# Altium project Main_PCB.PrjPcb
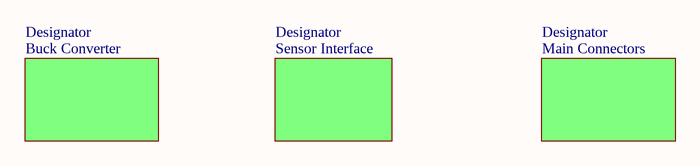
[diagram p0: MainPCB.SchDoc]
4 sheets, 53 parts. Net scope: flat (ports and power ports of the same name join across sheets).
Board file: MainPCB.PcbDoc
Sheets:
  MainPCB.SchDoc
    Designator = Buck Converter.SchDoc
    Designator = Sensor Interface.SchDoc
    Designator = Main Connectors.SchDoc

## Sheet MainPCB.SchDoc
size A4; SheetNumber: 1; SheetTotal: 4

### Sub-sheets
Designator = Buck Converter: no entries
Designator = Sensor Interface: no entries
Designator = Main Connectors: no entries

## Sheet Buck Converter.SchDoc
size A4; SheetNumber: 4; SheetTotal: 4
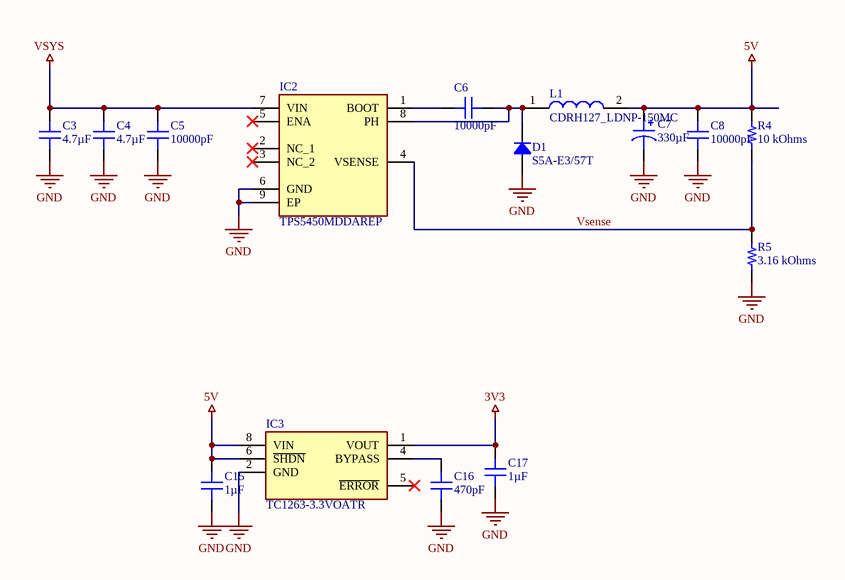
[diagram p1: Buck Converter.SchDoc]

### Parts
C3  4.7µF  [CAP 1206_3216 - 1.0MM]
C4  4.7µF  [CAP 1206_3216 - 1.0MM]
C5  10000pF  [CAP 0603_1608]
C6  10000pF  [CAP 0603_1608]
C7  330µF  [CAP ALSMD 6.6MM H7.7MM]
C8  10000pF  [CAP 0603_1608]
C15  1µF  [CAP 0603_1608]
C16  470pF  [CAP 0603_1608]
C17  1µF  [CAP 0603_1608]
D1  S5A-E3/57T  [DO214AB SMC]
IC2  TPS5450MDDAREP  [SOIC127P600X170-9N]
IC3  TC1263-3.3VOATR  [SOIC127P600X175-8N]
L1  CDRH127_LDNP-150MC  [INDPM120120X800N]
R4  10 kOhms  [RES 0603_1608]
R5  3.16 kOhms  [RES 0603_1608]

### Nets
3V3: C17.2 IC3.1(VOUT)
5V: C7.1 C8.2 C15.2 IC3.6(~{SHDN}) IC3.8(VIN) L1.2 R4.2
GND: C3.1 C4.1 C5.1 C7.2 C8.1 C15.1 C16.1 C17.1 D1.1 IC2.6(GND) IC2.9(EP) IC3.2(GND) R5.1
VSYS: C3.2 C4.2 C5.2 IC2.7(VIN)
Vsense: IC2.4(VSENSE) R4.1 R5.2
NetC6_1: C6.1 D1.2 IC2.8(PH) L1.1
NetC6_2: C6.2 IC2.1(BOOT)
NetC16_2: C16.2 IC3.4(BYPASS)

Not connected (* = marked no-connect by the designer): IC2 2(NC_1)* 3(NC_2)* 5(ENA)*; IC3 5(~{ERROR})*

### Library data of the parts
C3 C4 = C3216X7R1E475K085AB: CAP CER 4.7UF 25V X7R 1206; Manufacturer: TDK Corporation; Tolerance: ±10%; Part Number: C3216X7R1E475K085AB; Value: 4.7µF; Applications: General Purpose; Capacitance: 4.7µF; ComponentLink1Description: Datasheet; ComponentLink1URL: https://product.tdk.com/info/en/catalog/datasheets/mlcc_commercial_general_en.pdf?ref_disty=digikey; ComponentLink2Description: DigiKey Link; ComponentLink2URL: http://digikey.com/product-detail/en/tdk-corporation/C3216X7R1E475K085AB/445-14797-1-ND/3956463; Device Package: 1206 (3216 Metric); Features: Low ESL; LastUpdated: 2020-09-02 1:05:06 AM; Lifecycle Status: Active; Minimum Order: 1; Mounting Type: Surface Mount, MLCC; Operating Temperature: -55°C ~ 125°C; Package / Case: 1206 (3216 Metric); Packaging: TapeAndReel; PartId: 19105; Part Status: Active; Price: 0.08; Series: C; Size / Dimension: 0.126" L x 0.063" W (3.20mm x 1.60mm); Supplier 1: DigiKey; Supplier Part Number 1: 445-14797-1-ND; Temperature Coefficient: X7R; Thickness (Max): 0.039" (1.00mm); Voltage - Rated: 25V
C5 C6 C8 = C0603C103K5RAC7081: CE SMD 0603 .01UF 10% 50V X7R 2M; Manufacturer: KEMET; Part Number: C0603C103K5RAC7081; Value: 10000pF; Applications: Bypass, Decoupling; Capacitance: 10000pF; ComponentLink1Description: Datasheet; ComponentLink1URL: https://api.kemet.com/component-edge/download/specsheet/C0603C103K5RAC7081.pdf; ComponentLink2Description: DigiKey Link; ComponentLink2URL: http://digikey.com/product-detail/en/kemet/C0603C103K5RAC7081/399-C0603C103K5RAC7081CT-ND/10483117; Device Package: 0603 (1608 Metric); LastUpdated: 2020-09-02 1:03:31 AM; Lifecycle Status: Active; Minimum Order: 1; Mounting Type: Surface Mount, MLCC; Operating Temperature: -55°C ~ 125°C; Package / Case: 0603 (1608 Metric); Packaging: TapeAndReel; PartId: 5246; Part Status: Active; Price: 0.01; Series: SMD Comm X7R; Size / Dimension: 0.063" L x 0.031" W (1.60mm x 0.80mm); Supplier 1: DigiKey; Supplier Part Number 1: 399-C0603C103K5RAC7081CT-ND; Temperature Coefficient: X7R; Thickness (Max): 0.034" (0.87mm); Tolerance: ±10%; Voltage - Rated: 50V
C7 = 875105245015: CAP ALUM POLY 330UF 20% 10V SMD; Manufacturer: Würth Elektronik; ESR (Equivalent Series Resistance): 20mOhm; Lifetime @ Temp.: 2000 Hrs @ 105°C; Ripple Current @ High Frequency: 2.69A @ 100kHz; Ripple Current @ Low Frequency: 134.5mA @ 120Hz; Surface Mount Land Size: 0.260" L x 0.260" W (6.60mm x 6.60mm); Type: Polymer; Part Number: 875105245015; Applications: General Purpose; Capacitance: 330µF; ComponentLink1Description: Datasheet; ComponentLink1URL: https://katalog.we-online.de/pbs/datasheet/875105245015.pdf; ComponentLink2Description: DigiKey Link; ComponentLink2URL: http://digikey.com/product-detail/en/w-rth-elektronik/875105245015/732-6415-1-ND/5147966; Device Package: Radial, Can - SMD; Height - Seated (Max): 0.303" (7.70mm); LastUpdated: 2020-09-02 1:25:32 AM; Lifecycle Status: Active; Minimum Order: 1; Mounting Type: Surface Mount; Operating Temperature: -55°C ~ 105°C; Package / Case: Radial, Can - SMD; Packaging: TapeAndReel; PartId: 2228; Part Status: Active; Price: 0.40; Series: WCAP-PSLP; Size / Dimension: 0.248" Dia (6.30mm); Supplier 1: DigiKey; Supplier Part Number 1: 732-6415-1-ND; Tolerance: ±20%; Value: 330µF; Voltage - Rated: 10V
C15 C17 = C0603C105K4RACAUTO: CAP CER 0603 1UF 16V X7R 10%; Manufacturer: KEMET; Part Number: C0603C105K4RACAUTO; Value: 1µF; Applications: Automotive, Bypass, Decoupling; Capacitance: 1µF; ComponentLink1Description: Datasheet; ComponentLink1URL: https://api.kemet.com/component-edge/download/datasheet/C0603C105K4RACAUTO.pdf; ComponentLink2Description: DigiKey Link; ComponentLink2URL: http://digikey.com/product-detail/en/kemet/C0603C105K4RACAUTO/399-17704-1-ND/8635855; Device Package: 0603 (1608 Metric); LastUpdated: 2020-09-02 1:03:36 AM; Lifecycle Status: Active; Minimum Order: 1; Mounting Type: Surface Mount, MLCC; Operating Temperature: -55°C ~ 125°C; Package / Case: 0603 (1608 Metric); Packaging: TapeAndReel; PartId: 2179; Part Status: Active; Price: 0.02; Ratings: AEC-Q200; Series: SMD Auto X7R; Size / Dimension: 0.063" L x 0.031" W (1.60mm x 0.80mm); Supplier 1: DigiKey; Supplier Part Number 1: 399-17704-1-ND; Temperature Coefficient: X7R; Thickness (Max): 0.037" (0.95mm); Tolerance: ±10%; Voltage - Rated: 16V
C16 = C0603C471J3GACAUTO: CAP CER 470PF 25V C0G/NP0 0603; Manufacturer: KEMET; Temperature Coefficient: C0G, NP0; Tolerance: ±5%; Part Number: C0603C471J3GACAUTO; Value: 470pF; Applications: Automotive; Capacitance: 470pF; ComponentLink1Description: Datasheet; ComponentLink1URL: https://api.kemet.com/component-edge/download/datasheet/C0603C471J3GACAUTO.pdf; ComponentLink2Description: DigiKey Link; ComponentLink2URL: http://digikey.com/product-detail/en/kemet/C0603C471J3GACAUTO/399-6891-1-ND/3314402; Device Package: 0603 (1608 Metric); Features: Low ESL; LastUpdated: 2020-09-02 1:03:35 AM; Lifecycle Status: Active; Minimum Order: 1; Mounting Type: Surface Mount, MLCC; Operating Temperature: -55°C ~ 125°C; Package / Case: 0603 (1608 Metric); Packaging: TapeAndReel; PartId: 2407; Part Status: Active; Price: 0.08; Ratings: AEC-Q200; Series: SMD Auto C0G; Size / Dimension: 0.063" L x 0.031" W (1.60mm x 0.80mm); Supplier 1: DigiKey; Supplier Part Number 1: 399-6891-1-ND; Thickness (Max): 0.034" (0.87mm); Voltage - Rated: 25V
D1 = S5A-E3/57T: DIODE GEN PURP 50V 5A DO214AB; Manufacturer: Vishay Semiconductor Diodes Division; Capacitance @ Vr, F: 40pF @ 4V, 1MHz; Current - Reverse Leakage @ Vr: 10µA @ 50V; Diode Type: Standard; Reverse Recovery Time (trr): 2.5µs; Speed: Standard Recovery >500ns, > 200mA (Io); Voltage - Forward (Vf) (Max) @ If: 1.15V @ 5A; Part Number: S5A-E3/57T; ComponentLink1Description: Datasheet; ComponentLink1URL: http://www.vishay.com/docs/88931/s5a.pdf; ComponentLink2Description: DigiKey Link; ComponentLink2URL: http://digikey.com/product-detail/en/vishay-semiconductor-diodes-division/S5A-E3-57T/S5A-E3-57TGICT-ND/3646220; Current - Average Rectified (Io): 5A; LastUpdated: 2020-09-02 1:18:57 AM; Lifecycle Status: Active; Minimum Order: 1; Mounting Type: Surface Mount; Operating Temperature - Junction: -55°C ~ 150°C; Package / Case: DO-214AB, SMC; Packaging: TapeAndReel; PartId: 381; Part Status: Active; Price: 0.20; Series: -; Supplier 1: DigiKey; Supplier Part Number 1: S5A-E3/57TGICT-ND; Supplier Device Package: DO-214AB (SMC); Voltage - DC Reverse (Vr) (Max): 50V
IC2 = TPS5450MDDAREP: Integrated Circuit; Manufacturer_Name: Texas Instruments; Datasheet Link: http://www.ti.com/lit/gpn/tps5450-ep; Height: 1.7mm; Manufacturer_Part_Number: TPS5450MDDAREP
IC3 = TC1263-3.3VOATR: Integrated Circuit; Manufacturer_Name: Microchip; Datasheet Link: http://ww1.microchip.com/downloads/en/DeviceDoc/21374D.pdf; Height: 1.75mm; Manufacturer_Part_Number: TC1263-3.3VOATR; Mouser Part Number: 579-TC1263-3.3VOATR; Mouser Price/Stock: https://www.mouser.co.uk/ProductDetail/Microchip-Technology/TC1263-33VOATR?qs=JKWmWPM4binFIJC0VNJYCQ%3D%3D; Arrow Part Number: TC1263-3.3VOATR; Arrow Price/Stock: https://www.arrow.com/en/products/tc1263-3.3voatr/microchip-technology
L1 = CDRH127_LDNP-150MC: Inductor; Manufacturer_Name: Sumida; Manufacturer_Part_Number: CDRH127/LDNP-150MC; Datasheet Link: https://componentsearchengine.com/Datasheets/1/CDRH127_LDNP-150MC.pdf; Height: 8mm; Mouser Part Number: 851-CDRH127LDNP150MC; Mouser Price/Stock: https://www.mouser.co.uk/ProductDetail/Sumida/CDRH127-LDNP-150MC?qs=UC6tolJH7OiTViEpne7nQQ%3D%3D; Arrow Part Number: CDRH127/LDNP-150MC; Arrow Price/Stock: https://www.arrow.com/en/products/cdrh127ldnp-150mc/sumida?region=nac
R4 = AF0603FR-0710KL: RES SMD 10K OHM 1% 1/10W 0603; Manufacturer: Yageo; Power (Watts): 0.1W, 1/10W; Temperature Coefficient: ±100ppm/°C; Part Number: AF0603FR-0710KL; Value: 10 kOhms; ComponentLink1Description: Datasheet; ComponentLink1URL: http://www.yageo.com/documents/recent/PYu-AF_51_RoHS_L_6.pdf; ComponentLink2Description: DigiKey Link; ComponentLink2URL: http://digikey.com/product-detail/en/yageo/AF0603FR-0710KL/311-10KLMCT-ND/2828170; Composition: Thick Film; Device Package: 0603 (1608 Metric); Features: Anti-Sulfur, Moisture Resistant; Height - Seated (Max): 0.022" (0.55mm); LastUpdated: 2020-09-02 1:10:01 AM; Lifecycle Status: Active; Minimum Order: 1; Number of Terminations: 2; Operating Temperature: -55°C ~ 155°C; Package / Case: 0603 (1608 Metric); Packaging: TapeAndReel; PartId: 16021; Part Status: Active; Price: 0.01; Resistance: 10 kOhms; Series: AF; Size / Dimension: 0.063" L x 0.031" W (1.60mm x 0.80mm); Supplier 1: DigiKey; Supplier Part Number 1: 311-10KLMCT-ND; Supplier Device Package: 0603; Tolerance: ±1%
R5 = CR0603-FX-3161ELF: RES SMD 3.16K OHM 1% 1/10W 0603; Manufacturer: Bourns Inc.; Power (Watts): 0.1W, 1/10W; Temperature Coefficient: ±100ppm/°C; Part Number: CR0603-FX-3161ELF; Value: 3.16 kOhms; ComponentLink1Description: Datasheet; ComponentLink1URL: https://www.bourns.com/docs/Product-Datasheets/CHPREZTR.pdf; ComponentLink2Description: DigiKey Link; ComponentLink2URL: http://digikey.com/product-detail/en/bourns-inc/CR0603-FX-3161ELF/CR0603-FX-3161ELFCT-ND/4247773; Composition: Thick Film; Device Package: 0603 (1608 Metric); Features: Moisture Resistant; Height - Seated (Max): 0.022" (0.55mm); LastUpdated: 2020-09-02 1:10:18 AM; Lifecycle Status: Active; Minimum Order: 1; Number of Terminations: 2; Operating Temperature: -55°C ~ 155°C; Package / Case: 0603 (1608 Metric); Packaging: CutTape; PartId: 8282; Part Status: Active; Price: 0.10; Resistance: 3.16 kOhms; Series: CR0603; Size / Dimension: 0.063" L x 0.031" W (1.60mm x 0.80mm); Supplier 1: DigiKey; Supplier Part Number 1: CR0603-FX-3161ELFCT-ND; Supplier Device Package: 0603; Tolerance: ±1%

## Sheet Sensor Interface.SchDoc
size A4; SheetNumber: 3; SheetTotal: 4
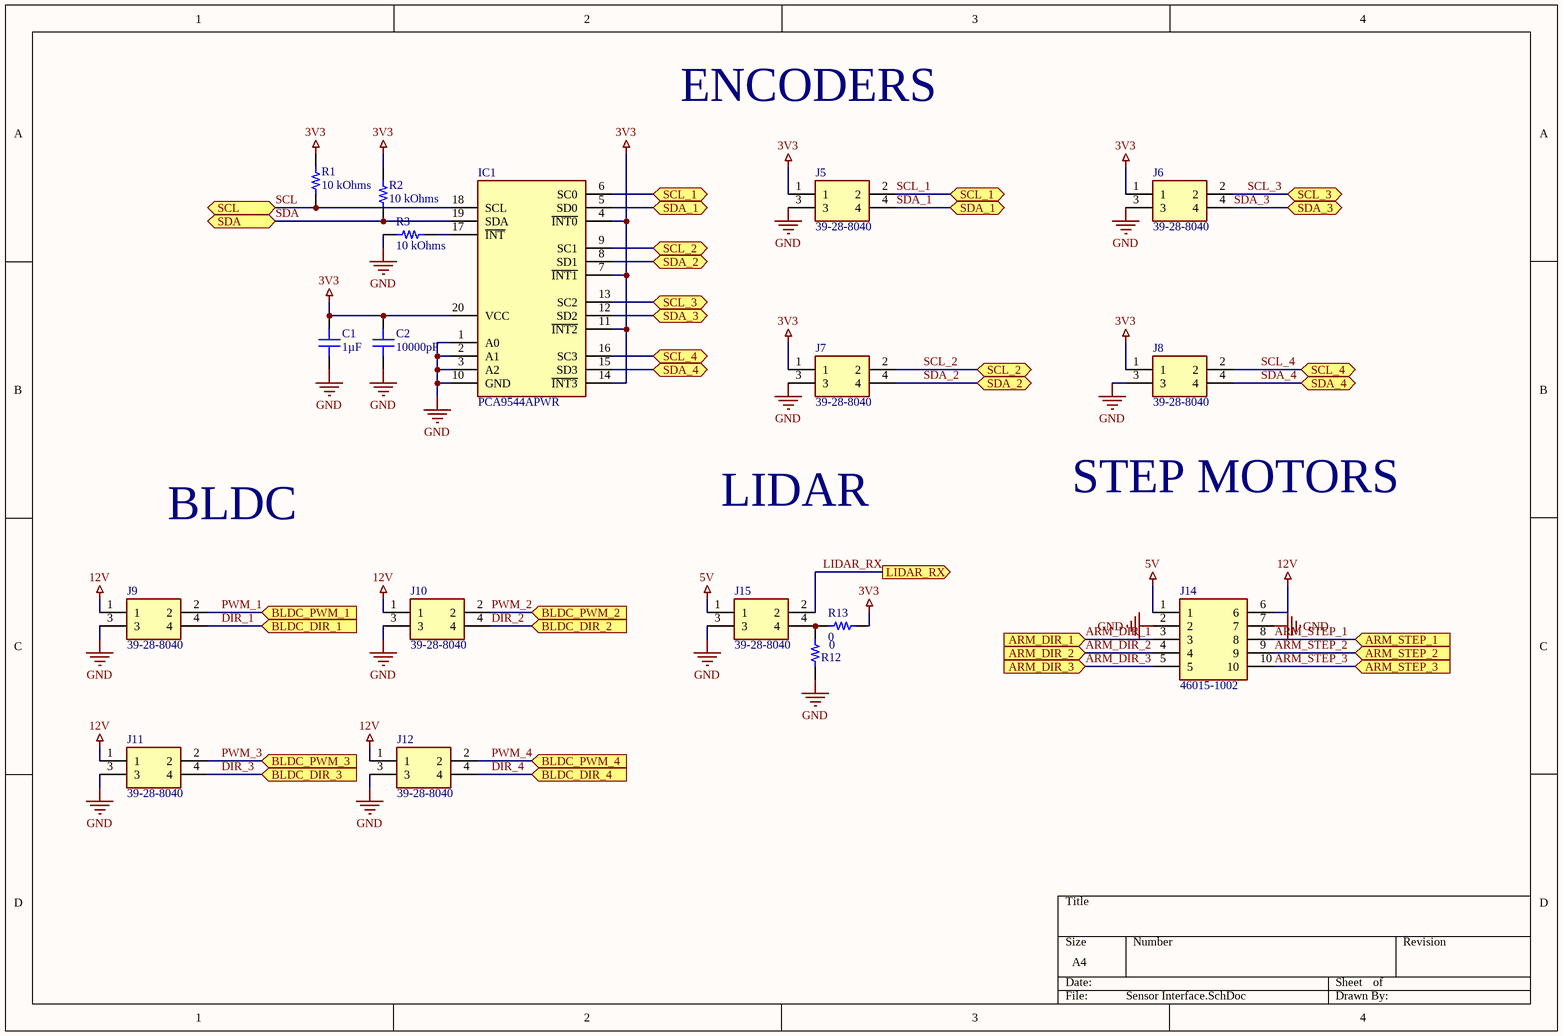
[diagram p2: Sensor Interface.SchDoc]

### Parts
C1  1µF  [CAP 0603_1608]
C2  10000pF  [CAP 0603_1608]
IC1  PCA9544APWR  [SOP65P640X120-20N]
J5  39-28-8040  [RHDR4W125P550X420_2X2_960X960X1310P]
J6  39-28-8040  [RHDR4W125P550X420_2X2_960X960X1310P]
J7  39-28-8040  [RHDR4W125P550X420_2X2_960X960X1310P]
J8  39-28-8040  [RHDR4W125P550X420_2X2_960X960X1310P]
J9  39-28-8040  [RHDR4W125P550X420_2X2_960X960X1310P]
J10  39-28-8040  [RHDR4W125P550X420_2X2_960X960X1310P]
J11  39-28-8040  [RHDR4W125P550X420_2X2_960X960X1310P]
J12  39-28-8040  [RHDR4W125P550X420_2X2_960X960X1310P]
J14  46015-1002  [460151002]
J15  39-28-8040  [RHDR4W125P550X420_2X2_960X960X1310P]
R1  10 kOhms  [RES 0603_1608]
R2  10 kOhms  [RES 0603_1608]
R3  10 kOhms  [RES 0603_1608]
R12  0  [RES 0603_1608]
R13  0  [RES 0603_1608]

### Ports
ARM_DIR_1 (in), ARM_DIR_2 (in), ARM_DIR_3 (in), ARM_STEP_1 (in), ARM_STEP_2 (in), ARM_STEP_3 (in), BLDC_DIR_1 (in), BLDC_DIR_2 (in), BLDC_DIR_3 (in), BLDC_DIR_4 (in), BLDC_PWM_1 (in), BLDC_PWM_2 (in), BLDC_PWM_3 (in), BLDC_PWM_4 (in), LIDAR_RX (out), SCL (bidir), SCL_1 (bidir), SCL_2 (bidir), SCL_3 (bidir), SCL_4 (bidir), SDA (bidir), SDA_1 (bidir), SDA_2 (bidir), SDA_3 (bidir), SDA_4 (bidir)

### Nets
3V3: C1.2 C2.2 IC1.4(~{INT0}) IC1.7(~{INT1}) IC1.11(~{INT2}) IC1.14(~{INT3}) IC1.20(VCC) J5.1 J6.1 J7.1 J8.1 R1.2 R2.2 R13.2
5V: J14.1 J15.1
12V: J9.1 J10.1 J11.1 J12.1 J14.6
GND: C1.1 C2.1 IC1.1(A0) IC1.2(A1) IC1.3(A2) IC1.10(GND) J5.3 J6.3 J7.3 J8.3 J9.3 J10.3 J11.3 J12.3 J14.2 J14.7 J15.3 R3.1 R12.1
ARM_DIR_1: J14.3 ; port ARM_DIR_1
ARM_DIR_2: J14.4 ; port ARM_DIR_2
ARM_DIR_3: J14.5 ; port ARM_DIR_3
ARM_STEP_1: J14.8 ; port ARM_STEP_1
ARM_STEP_2: J14.9 ; port ARM_STEP_2
ARM_STEP_3: J14.10 ; port ARM_STEP_3
DIR_1: J9.4 ; port BLDC_DIR_1
DIR_2: J10.4 ; port BLDC_DIR_2
DIR_3: J11.4 ; port BLDC_DIR_3
DIR_4: J12.4 ; port BLDC_DIR_4
LIDAR_RX: J15.2 ; port LIDAR_RX
PWM_1: J9.2 ; port BLDC_PWM_1
PWM_2: J10.2 ; port BLDC_PWM_2
PWM_3: J11.2 ; port BLDC_PWM_3
PWM_4: J12.2 ; port BLDC_PWM_4
SCL: IC1.18(SCL) R1.1 ; port SCL
SCL_1: IC1.6(SC0) J5.2 ; port SCL_1
SCL_2: IC1.9(SC1) J7.2 ; port SCL_2
SCL_3: IC1.13(SC2) J6.2 ; port SCL_3
SCL_4: IC1.16(SC3) J8.2 ; port SCL_4
SDA: IC1.19(SDA) R2.1 ; port SDA
SDA_1: IC1.5(SD0) J5.4 ; port SDA_1
SDA_2: IC1.8(SD1) J7.4 ; port SDA_2
SDA_3: IC1.12(SD2) J6.4 ; port SDA_3
SDA_4: IC1.15(SD3) J8.4 ; port SDA_4
NetIC1_17: IC1.17(~{INT}) R3.2
NetJ15_4: J15.4 R12.2 R13.1

### Notes on the sheet
- ENCODERS
- LIDAR
- STEP MOTORS
- BLDC

### Library data of the parts
C1 = C0603C105K4RACAUTO: as C15 on sheet Buck Converter; Part Number: C0603C105K4RACAUTO; Value: 1µF; Applications: Automotive, Bypass, Decoupling; Capacitance: 1µF; ComponentLink1Description: Datasheet; ComponentLink1URL: https://api.kemet.com/component-edge/download/datasheet/C0603C105K4RACAUTO.pdf; ComponentLink2Description: DigiKey Link; ComponentLink2URL: http://digikey.com/product-detail/en/kemet/C0603C105K4RACAUTO/399-17704-1-ND/8635855; Device Package: 0603 (1608 Metric); LastUpdated: 2020-09-02 1:03:36 AM; Lifecycle Status: Active; Minimum Order: 1; Mounting Type: Surface Mount, MLCC; Operating Temperature: -55°C ~ 125°C; Package / Case: 0603 (1608 Metric); Packaging: TapeAndReel; PartId: 2179; Part Status: Active; Price: 0.02; Ratings: AEC-Q200; Series: SMD Auto X7R; Size / Dimension: 0.063" L x 0.031" W (1.60mm x 0.80mm); Supplier 1: DigiKey; Supplier Part Number 1: 399-17704-1-ND; Temperature Coefficient: X7R; Thickness (Max): 0.037" (0.95mm); Tolerance: ±10%; Voltage - Rated: 16V
C2 = C0603C103M4RACAUTO: CAP CER 0603 .01UF 16V X7R 20% A; Manufacturer: KEMET; Part Number: C0603C103M4RACAUTO; Value: 10000pF; Applications: Automotive, Bypass, Decoupling; Capacitance: 10000pF; ComponentLink1Description: Datasheet; ComponentLink1URL: https://api.kemet.com/component-edge/download/datasheet/C0603C103M4RACAUTO.pdf; ComponentLink2Description: DigiKey Link; ComponentLink2URL: http://digikey.com/product-detail/en/kemet/C0603C103M4RACAUTO/399-13714-1-ND/6219642; Device Package: 0603 (1608 Metric); LastUpdated: 2020-09-02 1:03:33 AM; Lifecycle Status: Active; Minimum Order: 1; Mounting Type: Surface Mount, MLCC; Operating Temperature: -55°C ~ 125°C; Package / Case: 0603 (1608 Metric); Packaging: TapeAndReel; PartId: 3731; Part Status: Active; Price: 0.02; Ratings: AEC-Q200; Series: SMD Auto X7R; Size / Dimension: 0.063" L x 0.031" W (1.60mm x 0.80mm); Supplier 1: DigiKey; Supplier Part Number 1: 399-13714-1-ND; Temperature Coefficient: X7R; Thickness (Max): 0.034" (0.87mm); Tolerance: ±20%; Voltage - Rated: 16V
IC1 = PCA9544APWR: Integrated Circuit; Manufacturer_Name: Texas Instruments; Datasheet Link: http://www.ti.com/lit/gpn/pca9544a; Height: 1.2mm; Manufacturer_Part_Number: PCA9544APWR; Mouser Part Number: 595-PCA9544APWR; Mouser Price/Stock: https://www.mouser.co.uk/ProductDetail/Texas-Instruments/PCA9544APWR?qs=wgAEGBTxy7mScfqW4P%2FhLg%3D%3D; Arrow Part Number: PCA9544APWR; Arrow Price/Stock: https://www.arrow.com/en/products/pca9544apwr/texas-instruments
J5-J12 J15 = 39-28-8040: Connector; Manufacturer_Name: Molex; Datasheet Link: https://www.molex.com/webdocs/datasheets/pdf/en-us/0039288040_PCB_HEADERS.pdf; Height: 13.1mm; Manufacturer_Part_Number: 39-28-8040; Mouser Part Number: 538-39-28-8040; Mouser Price/Stock: https://www.mouser.co.uk/ProductDetail/Molex/39-28-8040?qs=SeTnVz%252B%252BFGDDzw7HSzN2Lw%3D%3D; Arrow Part Number: 39-28-8040; Arrow Price/Stock: https://www.arrow.com/en/products/39-28-8040/molex
J14 = 46015-1002: Connector; Manufacturer_Name: Molex; Datasheet Link: https://www.molex.com/pdm_docs/sd/460151002_sd.pdf; Height: 13.3mm; Manufacturer_Part_Number: 46015-1002; Mouser Part Number: 538-46015-1002; Mouser Price/Stock: https://www.mouser.co.uk/ProductDetail/Molex/46015-1002?qs=vuaaJtqKbMZiZUhECIrnag%3D%3D
R1-R3 = AF0603FR-0710KL: as R4 on sheet Buck Converter; Part Number: AF0603FR-0710KL; Value: 10 kOhms; ComponentLink1Description: Datasheet; ComponentLink1URL: http://www.yageo.com/documents/recent/PYu-AF_51_RoHS_L_6.pdf; ComponentLink2Description: DigiKey Link; ComponentLink2URL: http://digikey.com/product-detail/en/yageo/AF0603FR-0710KL/311-10KLMCT-ND/2828170; Composition: Thick Film; Device Package: 0603 (1608 Metric); Features: Anti-Sulfur, Moisture Resistant; Height - Seated (Max): 0.022" (0.55mm); LastUpdated: 2020-09-02 1:10:01 AM; Lifecycle Status: Active; Minimum Order: 1; Number of Terminations: 2; Operating Temperature: -55°C ~ 155°C; Package / Case: 0603 (1608 Metric); Packaging: TapeAndReel; PartId: 16021; Part Status: Active; Price: 0.01; Resistance: 10 kOhms; Series: AF; Size / Dimension: 0.063" L x 0.031" W (1.60mm x 0.80mm); Supplier 1: DigiKey; Supplier Part Number 1: 311-10KLMCT-ND; Supplier Device Package: 0603; Tolerance: ±1%
R12 R13 = TLRZ1JTTD: RES 0 OHM JUMPER 0603; Manufacturer: KOA Speer Electronics, Inc.; Part Number: TLRZ1JTTD; ComponentLink1Description: Datasheet; ComponentLink1URL: http://www.koaspeer.com/catimages/Products/TLRZ/TLRZ.pdf; ComponentLink2Description: DigiKey Link; ComponentLink2URL: http://digikey.com/product-detail/en/koa-speer-electronics-inc/TLRZ1JTTD/2019-TLRZ1JTTDCT-ND/9847537; Composition: Metal Element; Device Package: 0603 (1608 Metric); Features: Automotive AEC-Q200, Current Sense; Height - Seated (Max): 0.022" (0.55mm); LastUpdated: 2020-09-02 1:10:25 AM; Lifecycle Status: Active; Minimum Order: 1; Number of Terminations: 2; Operating Temperature: -55°C ~ 170°C; Package / Case: 0603 (1608 Metric); Packaging: TapeAndReel; PartId: 4851; Part Status: Active; Price: 0.08; Ratings: AEC-Q200; Series: TLRZ; Size / Dimension: 0.063" L x 0.031" W (1.60mm x 0.80mm); Supplier 1: DigiKey; Supplier Part Number 1: 2019-TLRZ1JTTDCT-ND; Supplier Device Package: 0603; Tolerance: Jumper

## Sheet Main Connectors.SchDoc
size A4; SheetNumber: 2; SheetTotal: 4
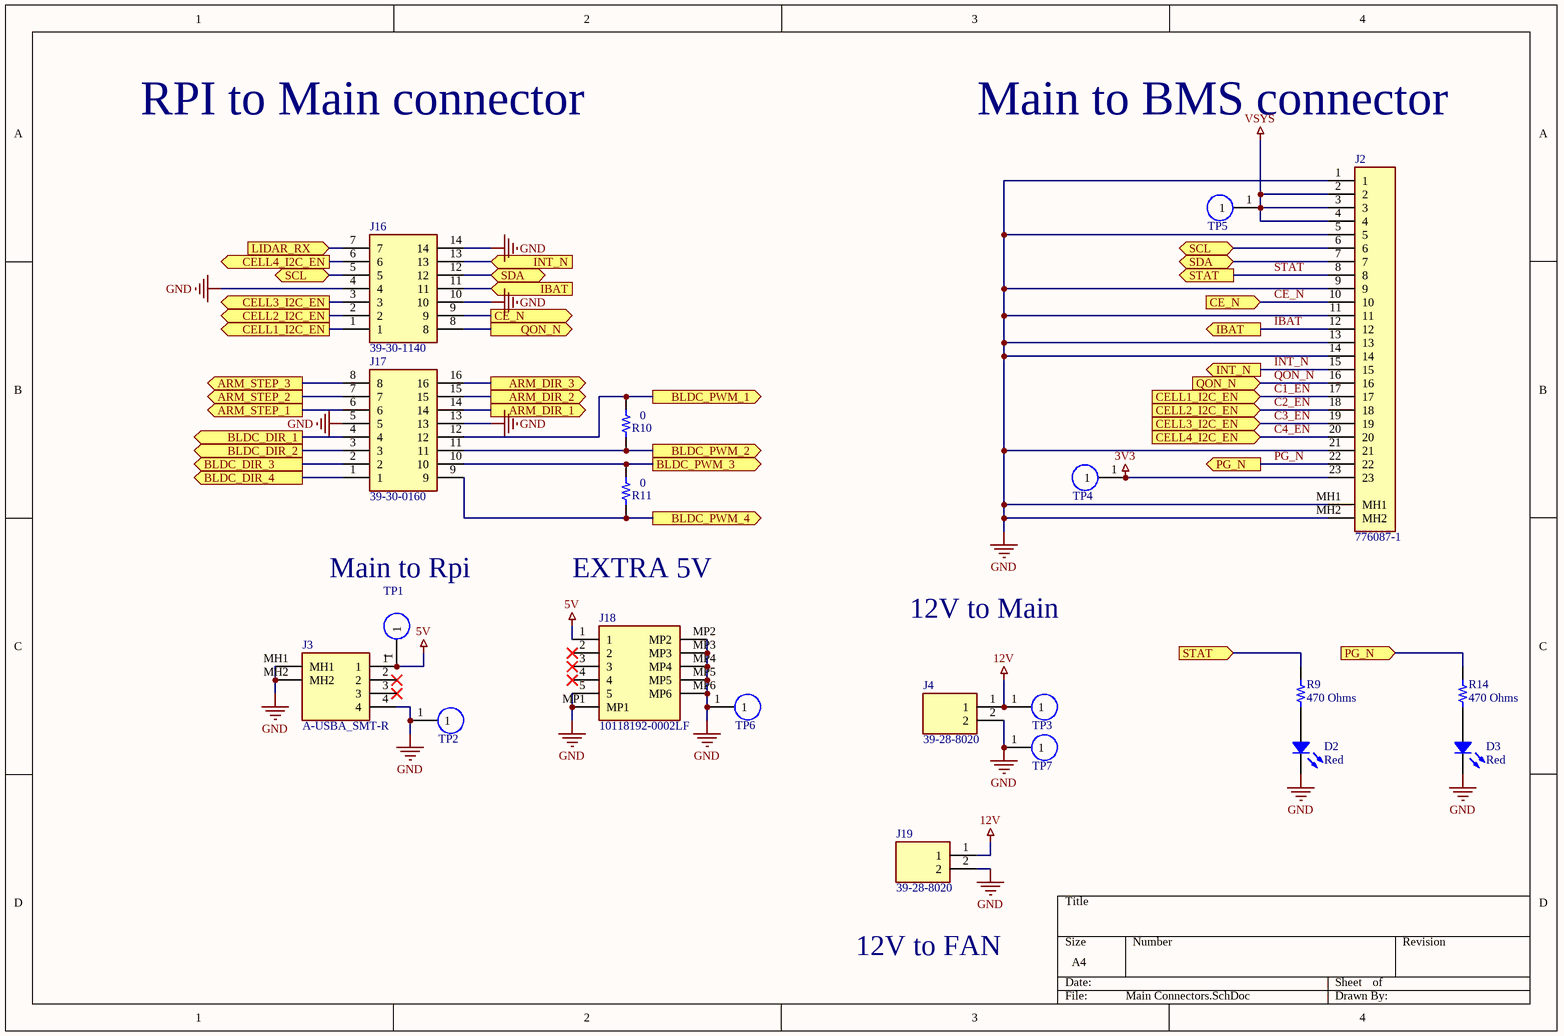
[diagram p3: Main Connectors.SchDoc]

### Parts
D2  Red  [LED 0805_2012 RED]
D3  Red  [LED 0805_2012 RED]
J2  776087-1  [7760871]
J3  A-USBA_SMT-R  [AUSBASMTR]
J4  39-28-8020  [SHDR2W125P550X420_2X1_540X960X1310P]
J16  39-30-1140  [39301142]
J17  39-30-0160  [39301160]
J18  10118192-0002LF  [101181920002LF]
J19  39-28-8020  [SHDR2W125P550X420_2X1_540X960X1310P]
R9  470 Ohms  [RES 0603_1608]
R10  0  [RES 0603_1608]
R11  0  [RES 0603_1608]
R14  470 Ohms  [RES 0603_1608]
TP1  380-10-101-00-002000  [HDRV1W51P0X254_1X1_254X254X470P]  (value not drawn)
TP2  380-10-101-00-002000  [HDRV1W51P0X254_1X1_254X254X470P]  (value not drawn)
TP3  380-10-101-00-002000  [HDRV1W51P0X254_1X1_254X254X470P]  (value not drawn)
TP4  380-10-101-00-002000  [HDRV1W51P0X254_1X1_254X254X470P]  (value not drawn)
TP5  380-10-101-00-002000  [HDRV1W51P0X254_1X1_254X254X470P]  (value not drawn)
TP6  380-10-101-00-002000  [HDRV1W51P0X254_1X1_254X254X470P]  (value not drawn)
TP7  380-10-101-00-002000  [HDRV1W51P0X254_1X1_254X254X470P]  (value not drawn)

### Ports
ARM_DIR_1 (out), ARM_DIR_2 (out), ARM_DIR_3 (out), ARM_STEP_1 (out), ARM_STEP_2 (out), ARM_STEP_3 (out), BLDC_DIR_1 (out), BLDC_DIR_2 (out), BLDC_DIR_3 (out), BLDC_DIR_4 (out), BLDC_PWM_1 (out), BLDC_PWM_2 (out), BLDC_PWM_3 (out), BLDC_PWM_4 (out), CE_N (in), CE_N (out), CELL1_I2C_EN (in), CELL1_I2C_EN (out), CELL2_I2C_EN (in), CELL2_I2C_EN (out), CELL3_I2C_EN (in), CELL3_I2C_EN (out), CELL4_I2C_EN (in), CELL4_I2C_EN (out), IBAT (in), IBAT (out), INT_N (in), INT_N (out), LIDAR_RX (in), PG_N (in), PG_N (out), QON_N (in), QON_N (out), SCL (bidir), SDA (bidir), STAT (in), STAT (out)

### Nets
3V3: J2.23 TP4.1
5V: J3.1 J18.1 TP1.1
12V: J4.1 J19.1 TP3.1
GND: D2.2 D3.2 J2.1 J2.5 J2.9 J2.11 J2.13 J2.14 J2.21 J2.MH1 J2.MH2 J3.4 J3.MH1 J3.MH2 J4.2 J16.4 J16.10 J16.14 J17.5 J17.13 J18.5 J18.MP1 J18.MP2 J18.MP3 J18.MP4 J18.MP5 J18.MP6 J19.2 TP2.1 TP6.1 TP7.1
VSYS: J2.2 J2.3 J2.4 TP5.1
ARM_DIR_1: J17.14 ; port ARM_DIR_1
ARM_DIR_2: J17.15 ; port ARM_DIR_2
ARM_DIR_3: J17.16 ; port ARM_DIR_3
ARM_STEP_1: J17.6 ; port ARM_STEP_1
ARM_STEP_2: J17.7 ; port ARM_STEP_2
ARM_STEP_3: J17.8 ; port ARM_STEP_3
C1_EN: J2.17 J16.1 ; port CELL1_I2C_EN
C2_EN: J2.18 J16.2 ; port CELL2_I2C_EN
C3_EN: J2.19 J16.3 ; port CELL3_I2C_EN
C4_EN: J2.20 J16.6 ; port CELL4_I2C_EN
CE_N: J2.10 J16.9 ; port CE_N
DIR_1: J17.4 ; port BLDC_DIR_1
DIR_2: J17.3 ; port BLDC_DIR_2
DIR_3: J17.2 ; port BLDC_DIR_3
DIR_4: J17.1 ; port BLDC_DIR_4
IBAT: J2.12 J16.11 ; port IBAT
INT_N: J2.15 J16.13 ; port INT_N
LIDAR_RX: J16.7 ; port LIDAR_RX
PG_N: J2.22 R14.2 ; port PG_N
PWM_1: J17.12 R10.2 ; port BLDC_PWM_1
PWM_2: J17.11 R10.1 ; port BLDC_PWM_2
PWM_3: J17.10 R11.2 ; port BLDC_PWM_3
PWM_4: J17.9 R11.1 ; port BLDC_PWM_4
QON_N: J2.16 J16.8 ; port QON_N
SCL: J2.6 J16.5 ; port SCL
SDA: J2.7 J16.12 ; port SDA
STAT: J2.8 R9.2 ; port STAT
NetD2_1: D2.1 R9.1
NetD3_1: D3.1 R14.1

Not connected (* = marked no-connect by the designer): J3 2* 3*; J18 2* 3* 4*

### Notes on the sheet
- RPI to Main connector
- Main to BMS connector
- Main to Rpi
- EXTRA 5V
- 12V to Main
- 12V to FAN

### Library data of the parts
D2 D3 = CMD17-21VRD/TR8: LED RED DIFFUSED 0805 SMD; Manufacturer: Visual Communications Company - VCC; Configuration: Standard; Current - Test: 20mA; Lens Size: 1.40mm x 1.25mm; Lens Style: Rectangle with Flat Top; Millicandela Rating: 6mcd; Viewing Angle: 140°; Voltage - Forward (Vf) (Typ): 2V; Wavelength - Peak: 640nm; Part Number: CMD17-21VRD/TR8; Color: Red; ComponentLink1Description: Datasheet; ComponentLink1URL: https://vcclite.com/wp-content/uploads/wpallimport/files/files/CMD1721Seriesver3.pdf; ComponentLink2Description: DigiKey Link; ComponentLink2URL: http://digikey.com/product-detail/en/visual-communications-company-vcc/CMD17-21VRD-TR8/L62501CT-ND/254934; Device Package: 0805 (2012 Metric); Height (Max): 1.20mm; LastUpdated: 2020-09-02 1:21:00 AM; Lens Color: Red; Lens Transparency: Diffused; Lifecycle Status: Active; Minimum Order: 1; Mounting Type: Surface Mount; Package / Case: 0805 (2012 Metric); Packaging: TapeAndReel; PartId: 366; Part Status: Active; Price: 0.12; Series: CMD17-21; Size / Dimension: 2.00mm L x 1.25mm W; Supplier 1: DigiKey; Supplier Part Number 1: L62501CT-ND; Supplier Device Package: 0805; Value: Red
J2 = 776087-1: Connector; Manufacturer_Name: TE Connectivity; Datasheet Link: https://componentsearchengine.com/Datasheets/1/776087-1.pdf; Height: 32.1mm; Manufacturer_Part_Number: 776087-1; Mouser Part Number: 571-776087-1; Mouser Price/Stock: https://www.mouser.co.uk/ProductDetail/TE-Connectivity/776087-1?qs=qXO2HHLAcoIjggUTPuCD9w%3D%3D; Arrow Part Number: 776087-1; Arrow Price/Stock: https://www.arrow.com/en/products/776087-1/te-connectivity?region=europe
J3 = A-USBA_SMT-R: Connector; Manufacturer_Name: ASSMANN WSW components GmbH; Manufacturer_Part_Number: A-USBA/SMT-R; Height: 7.12mm
J4 J19 = 39-28-8020: Connector; Manufacturer_Name: Molex; Datasheet Link: http://www.molex.com/molex/products/datasheet.jsp?part=active/0039288020_PCB_HEADERS.xml; Height: 13.1mm; Manufacturer_Part_Number: 39-28-8020; Mouser Part Number: 538-39-28-8020; Mouser Price/Stock: https://www.mouser.co.uk/ProductDetail/Molex/39-28-8020?qs=ZZBj1wiNDbnzWLcHr%2Fqwqw%3D%3D
J16 = 39-30-1140: Connector; Manufacturer_Name: Molex; Datasheet Link: https://www.molex.com/pdm_docs/sd/039301140_sd.pdf; Height: 11.25mm; Manufacturer_Part_Number: 39-30-1140; Mouser Part Number: 538-39-30-1140; Mouser Price/Stock: https://www.mouser.co.uk/ProductDetail/Molex/39-30-1140?qs=ZZBj1wiNDbmCkxw7hxL8nQ%3D%3D
J17 = 39-30-0160: Connector; Manufacturer_Name: Molex; Datasheet Link: https://www.molex.com/pdm_docs/sd/039300160_sd.pdf; Height: 9mm; Manufacturer_Part_Number: 39-30-0160; Mouser Part Number: 538-39-30-0160; Mouser Price/Stock: https://www.mouser.co.uk/ProductDetail/Molex/39-30-0160?qs=KHty%2FoMxDPnJHzmu54XA5A%3D%3D
J18 = 10118192-0002LF: Connector; Manufacturer_Name: Amphenol; Datasheet Link: https://componentsearchengine.com/Datasheets/1/10118192-0002LF.pdf; Height: 3.05mm; Manufacturer_Part_Number: 10118192-0002LF; Mouser Part Number: 649-10118192-0002LF; Mouser Price/Stock: https://www.mouser.co.uk/ProductDetail/Amphenol-FCI/10118192-0002LF?qs=KVgMXE4aH4nIkuWlMxQzog%3D%3D; Arrow Part Number: 10118192-0002LF; Arrow Price/Stock: https://www.arrow.com/en/products/10118192-0002lf/amphenol-fci?region=nac
R9 R14 = ERJ-3EKF4700V: RES SMD 470 OHM 1% 1/10W 0603; Manufacturer: Panasonic Electronic Components; Power (Watts): 0.1W, 1/10W; Temperature Coefficient: ±100ppm/°C; Part Number: ERJ-3EKF4700V; Value: 470 Ohms; ComponentLink1Description: Datasheet; ComponentLink1URL: https://industrial.panasonic.com/cdbs/www-data/pdf/RDA0000/AOA0000C304.pdf; ComponentLink2Description: DigiKey Link; ComponentLink2URL: http://digikey.com/product-detail/en/panasonic-electronic-components/ERJ-3EKF4700V/P470HCT-ND/1746781; Composition: Thick Film; Device Package: 0603 (1608 Metric); Features: Automotive AEC-Q200; Height - Seated (Max): 0.022" (0.55mm); LastUpdated: 2020-09-02 1:10:23 AM; Lifecycle Status: Active; Minimum Order: 1; Number of Terminations: 2; Operating Temperature: -55°C ~ 155°C; Package / Case: 0603 (1608 Metric); Packaging: TapeAndReel; PartId: 5664; Part Status: Active; Price: 0.01; Ratings: AEC-Q200; Resistance: 470 Ohms; Series: ERJ; Size / Dimension: 0.063" L x 0.031" W (1.60mm x 0.80mm); Supplier 1: DigiKey; Supplier Part Number 1: P470HCT-ND; Supplier Device Package: 0603; Tolerance: ±1%
R10 R11 = TLRZ1JTTD: as R12 on sheet Sensor Interface; Part Number: TLRZ1JTTD; ComponentLink1Description: Datasheet; ComponentLink1URL: http://www.koaspeer.com/catimages/Products/TLRZ/TLRZ.pdf; ComponentLink2Description: DigiKey Link; ComponentLink2URL: http://digikey.com/product-detail/en/koa-speer-electronics-inc/TLRZ1JTTD/2019-TLRZ1JTTDCT-ND/9847537; Composition: Metal Element; Device Package: 0603 (1608 Metric); Features: Automotive AEC-Q200, Current Sense; Height - Seated (Max): 0.022" (0.55mm); LastUpdated: 2020-09-02 1:10:25 AM; Lifecycle Status: Active; Minimum Order: 1; Number of Terminations: 2; Operating Temperature: -55°C ~ 170°C; Package / Case: 0603 (1608 Metric); Packaging: TapeAndReel; PartId: 4851; Part Status: Active; Price: 0.08; Ratings: AEC-Q200; Series: TLRZ; Size / Dimension: 0.063" L x 0.031" W (1.60mm x 0.80mm); Supplier 1: DigiKey; Supplier Part Number 1: 2019-TLRZ1JTTDCT-ND; Supplier Device Package: 0603; Tolerance: Jumper
TP1-TP7 = 380-10-101-00-002000: Connector; Manufacturer_Name: Mill-Max; Datasheet Link: https://datasheet.datasheetarchive.com/originals/distributors/DKDS-31/604668.pdf; Height: 4.7mm; Manufacturer_Part_Number: 380-10-101-00-002000; Mouser Part Number: 575-3801010100002000; Mouser Price/Stock: https://www.mouser.com/Search/Refine.aspx?Keyword=575-3801010100002000; Arrow Part Number: 380-10-101-00-002000; Arrow Price/Stock: https://www.arrow.com/en/products/380-10-101-00-002000/mill-max

## Nets that join several sheets
3V3: Buck Converter (C17.2 IC3.1), Sensor Interface (14 pins), Main Connectors (J2.23 TP4.1)
5V: Buck Converter (7 pins), Sensor Interface (J14.1 J15.1), Main Connectors (J3.1 J18.1 TP1.1)
12V: Sensor Interface (5 pins), Main Connectors (J4.1 J19.1 TP3.1)
GND: Buck Converter (13 pins), Sensor Interface (19 pins), Main Connectors (31 pins)
VSYS: Buck Converter (C3.2 C4.2 C5.2 IC2.7), Main Connectors (J2.2 J2.3 J2.4 TP5.1)
ARM_DIR_1: Sensor Interface (J14.3), Main Connectors (J17.14)
ARM_DIR_2: Sensor Interface (J14.4), Main Connectors (J17.15)
ARM_DIR_3: Sensor Interface (J14.5), Main Connectors (J17.16)
ARM_STEP_1: Sensor Interface (J14.8), Main Connectors (J17.6)
ARM_STEP_2: Sensor Interface (J14.9), Main Connectors (J17.7)
ARM_STEP_3: Sensor Interface (J14.10), Main Connectors (J17.8)
DIR_1: Sensor Interface (J9.4), Main Connectors (J17.4)
DIR_2: Sensor Interface (J10.4), Main Connectors (J17.3)
DIR_3: Sensor Interface (J11.4), Main Connectors (J17.2)
DIR_4: Sensor Interface (J12.4), Main Connectors (J17.1)
LIDAR_RX: Sensor Interface (J15.2), Main Connectors (J16.7)
PWM_1: Sensor Interface (J9.2), Main Connectors (J17.12 R10.2)
PWM_2: Sensor Interface (J10.2), Main Connectors (J17.11 R10.1)
PWM_3: Sensor Interface (J11.2), Main Connectors (J17.10 R11.2)
PWM_4: Sensor Interface (J12.2), Main Connectors (J17.9 R11.1)
SCL: Sensor Interface (IC1.18 R1.1), Main Connectors (J2.6 J16.5)
SDA: Sensor Interface (IC1.19 R2.1), Main Connectors (J2.7 J16.12)